# Altium schematic sheet LM-008.SchDoc: Main
size Tabloid; DocumentNumber: LM-008; Revision: B; SheetNumber: 3; SheetTotal: 3; DocumentName: LM-008
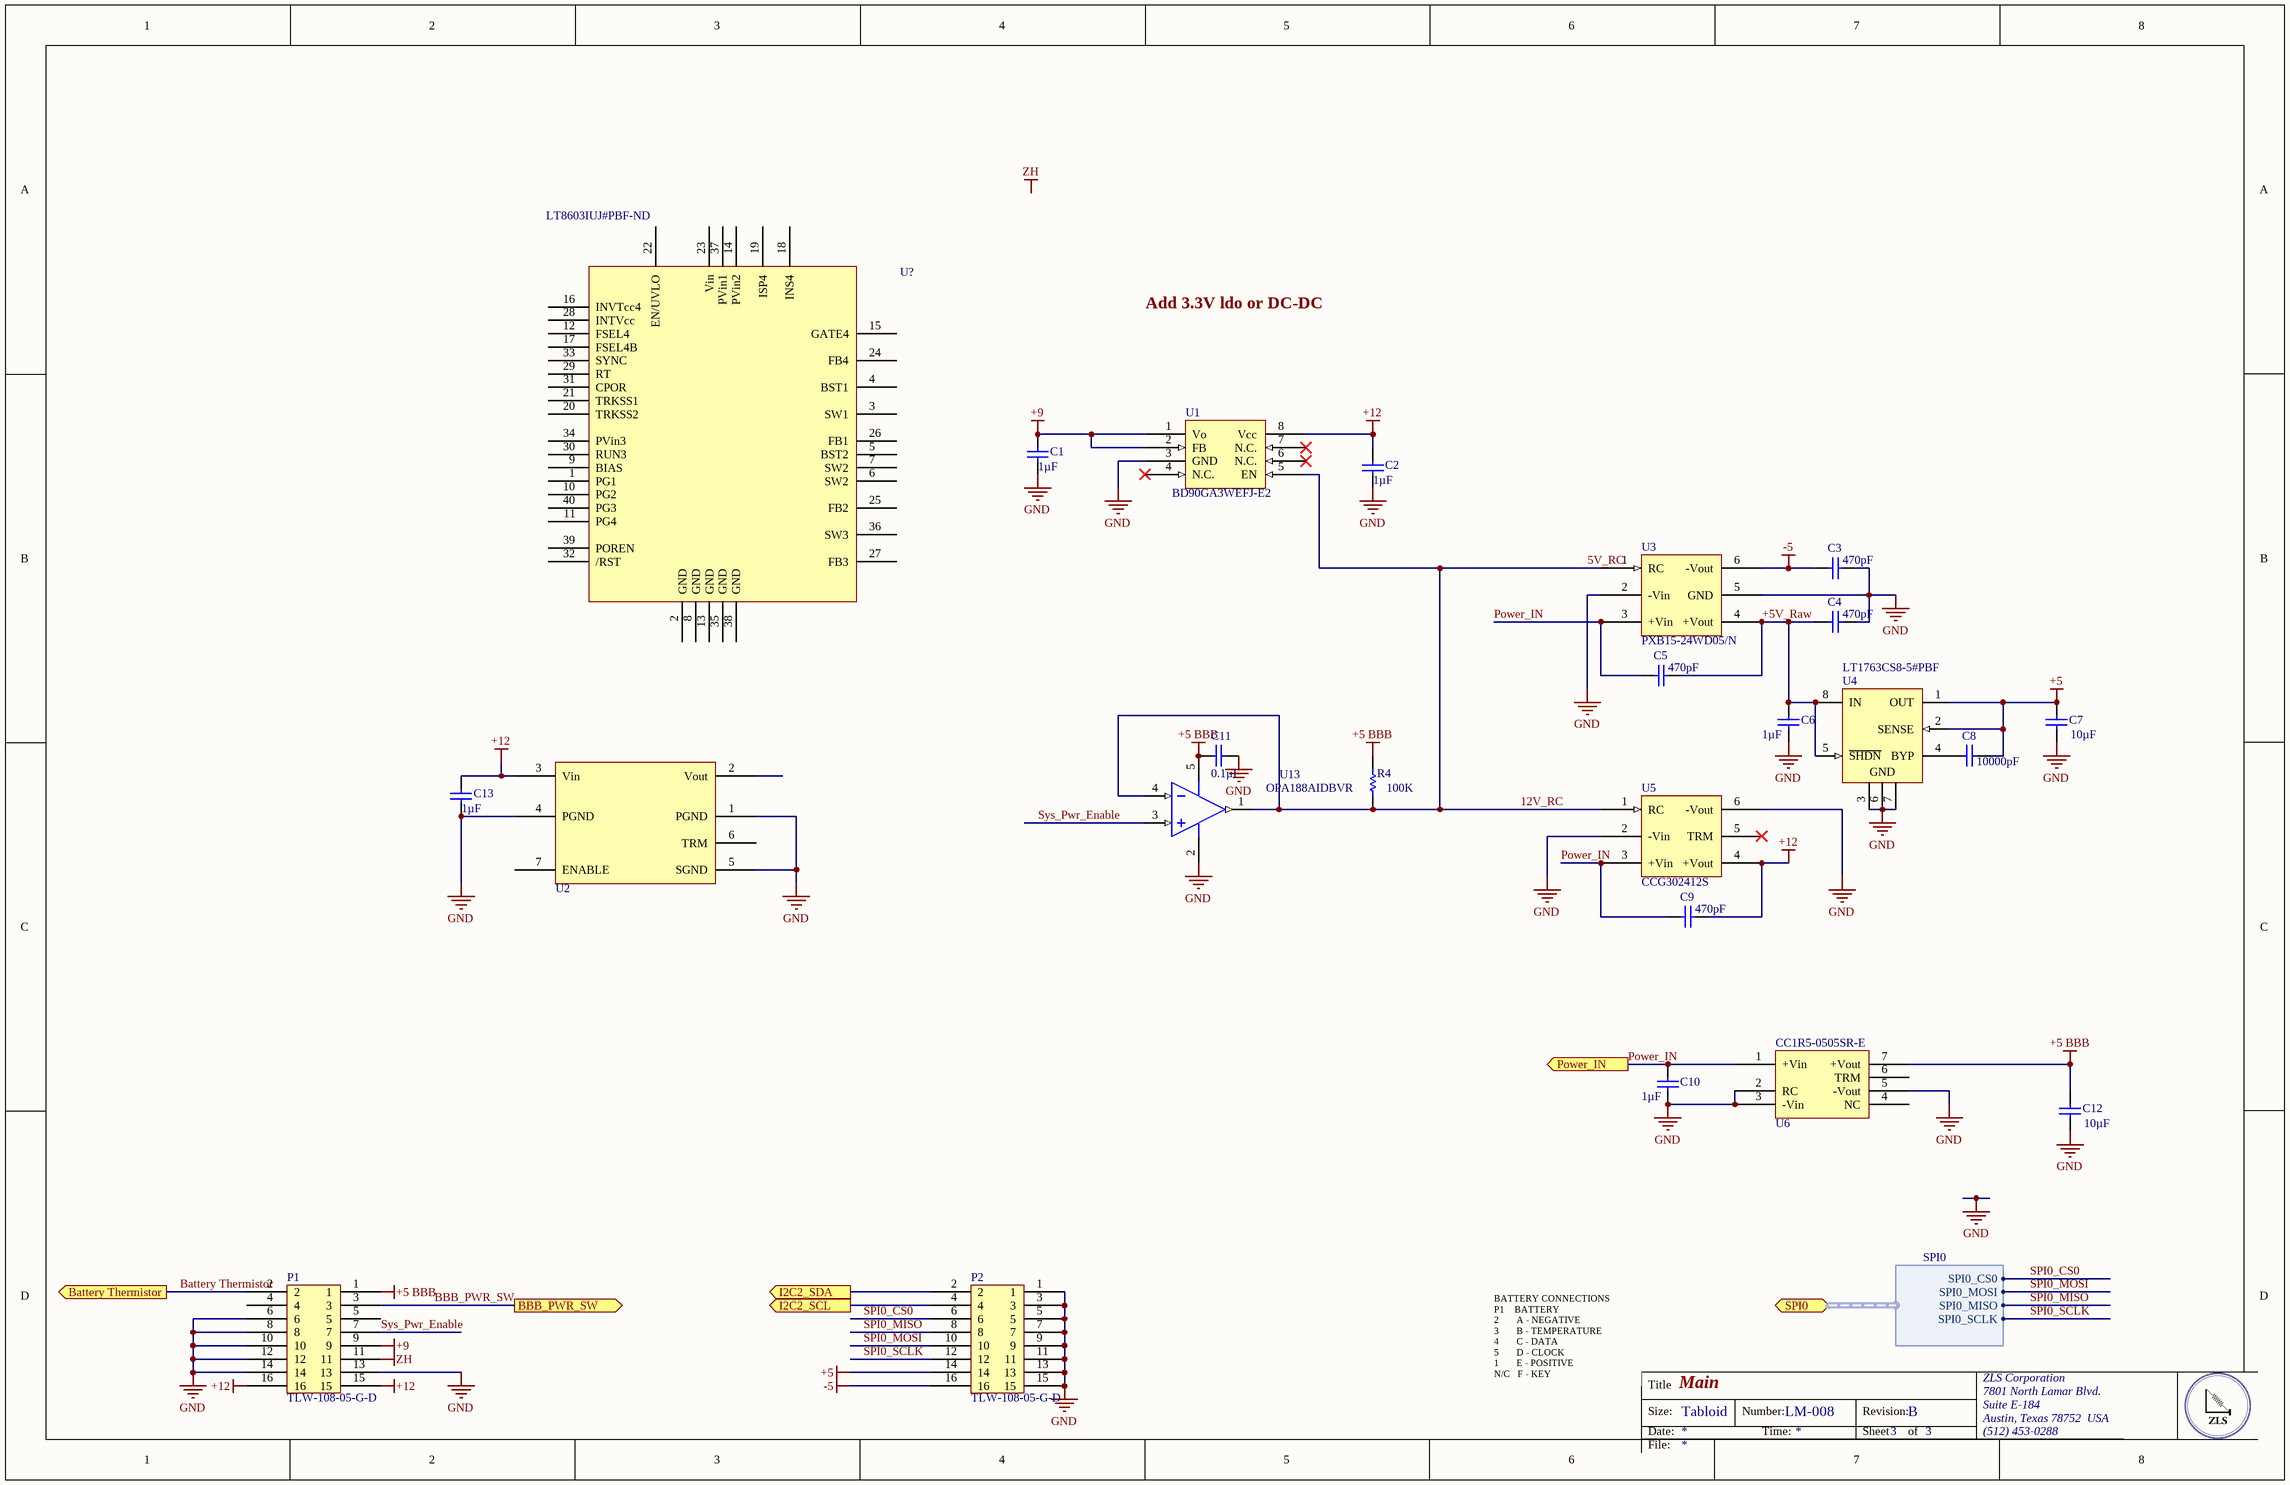
[diagram p0: LM-008.SchDoc]

## Parts
C1  Capacitance: 1µF  [CAPC1206(3216)130_N]  (hidden comment: CAP CER 1UF 50V X7R 1210)
C2  Capacitance: 1µF  [CAPC1206(3216)130_N]  (hidden comment: CAP CER 1UF 50V X7R 1210)
C3  Capacitance: 470pF  [CAPC1812(4532)230_M]  (hidden comment: CAP CER 470PF 3KV X7R 1812)
C4  Capacitance: 470pF  [CAPC1812(4532)230_M]  (hidden comment: CAP CER 470PF 3KV X7R 1812)
C5  Capacitance: 470pF  [CAPC1812(4532)230_M]  (hidden comment: CAP CER 470PF 3KV X7R 1812)
C6  Capacitance: 1µF  [CAPC1210(3225)100_L]  (hidden comment: CAP CER 1UF 50V X7R 1210)
C7  Capacitance: 10µF  [CAPC0805(2012)145_N]  (hidden comment: CAP CER 10UF 10V X7R 0805)
C8  Capacitance: 10000pF  [CAPC0805(2012)145_N]  (hidden comment: CAP CER 10000PF 25V X7R 0805)
C9  Capacitance: 470pF  [CAPC1812(4532)230_M]  (hidden comment: CAP CER 470PF 3KV X7R 1812)
C10  Capacitance: 1µF  [CAPC1210(3225)100_L]  (hidden comment: CAP CER 1UF 50V X7R 1210)
C11  Capacitance: 0.1µF  [CAPC0805(2012)145_N]  (hidden comment: CAP CER 0.1UF 16V X7R 0805)
C12  Capacitance: 10µF  [CAPC0805(2012)145_N]  (hidden comment: CAP CER 10UF 10V X7R 0805)
C13  Capacitance: 1µF  [CAPC0805(2012)145_N]  (hidden comment: CAP CER 1UF 16V X7R 0805)
P1  TLW-108-05-G-D  [TLW-108-05-G-D]
P2  TLW-108-05-G-D  [TLW-108-05-G-D]
R4  100K  [RESC0402(1005)_L]
U1  BD90GA3WEFJ-E2  [TSOP127P600X100-8N]
U2  ABXS002A3X41-SRZ  [ABXS002A3X41-SRZ]  (value not drawn)
U3  PXB15-24WD05/N  [PXB15-24WD05/N]
U4  LT1763CS8-5#PBF  [LT-S8-8_M]
U5  CCG302412S  [CCG30]
U6  CC1R5-0505SR-E  [CC1R5-0505SR-E]
U13  OPA188AIDBVR  [DBV0005A_M]
U?  Supplier Part Number 1: LT8603IUJ#PBF-ND  [LT8603IUJ#PBF]  (hidden comment: LT8603IUJ#PBF)

## Ports
Battery Thermistor (out), BBB_PWR_SW (out), I2C2_SCL (out), I2C2_SDA (out), Power_IN (out), SPI0 (harness SPI0)

## Harnesses
SPI0: SPI0_CS0, SPI0_MOSI, SPI0_MISO, SPI0_SCLK

## Nets
+5: C7.2 C8.1 P2.14 U4.1(OUT) U4.2(SENSE)
+5 BBB: C11.1 C12.2 P1.1 R4.2 U6.7(+Vout) U13.5(V+)
+9: C1.2 P1.9 U1.1(Vo) U1.2(FB)
+12: C2.2 C9.2 C13.2 P1.15 P1.16 U1.8(Vcc) U2.3(Vin) U5.4(+Vout)
-5: C3.1 P2.16 U3.6(-Vout)
GND: C1.1 C2.1 C3.2 C4.2 C6.1 C7.1 C10.1 C11.2 C12.1 C13.1 P1.6 P1.8 P1.10 P1.12 P1.13 P1.14 P2.1 P2.3 P2.5 P2.7 P2.9 P2.11 P2.13 P2.15 U1.3(GND) U2.1(PGND) U2.4(PGND) U2.5(SGND) U3.2(-Vin) U3.5(GND) U4.3(GND) U4.6(GND) U4.7(GND) U5.2(-Vin) U5.6(-Vout) U6.2(RC) U6.3(-Vin) U6.5(-Vout) U13.2(V-)
ZH: P1.11
12V_RC: R4.1 U1.5(EN) U3.1(RC) U5.1(RC) U13.1(OUT) U13.4(IN-)  [also labelled 5V_RC]
+5V_Raw: C4.1 C5.2 C6.2 U3.4(+Vout) U4.5(~{SHDN}) U4.8(IN)
Battery Thermistor: P1.2 ; port Battery Thermistor
BBB_PWR_SW: P1.3 ; port BBB_PWR_SW
I2C2_SCL: P2.4 ; port I2C2_SCL
I2C2_SDA: P2.2 ; port I2C2_SDA
Power_IN: C5.1 C9.1 C10.2 U3.3(+Vin) U5.3(+Vin) U6.1(+Vin) ; port Power_IN
SPI0_CS0: P2.6 ; port SPI0.SPI0_CS0
SPI0_MISO: P2.8 ; port SPI0.SPI0_MISO
SPI0_MOSI: P2.10 ; port SPI0.SPI0_MOSI
SPI0_SCLK: P2.12 ; port SPI0.SPI0_SCLK
Sys_Pwr_Enable: P1.7 U13.3(IN+)
NetC8_2: C8.2 U4.4(BYP)

Not connected (* = marked no-connect by the designer): P1 4 5; U1 4(N.C.)* 6(N.C.)* 7(N.C.)*; U2 2(Vout) 6(TRM) 7(ENABLE); U5 5(TRM)*; U6 4(NC) 6(TRM); U? 1(PG1) 2(GND) 3(SW1) 4(BST1) 5(BST2) 6(SW2) 7(SW2) 8(GND) 9(BIAS) 10(PG2) 11(PG4) 12(FSEL4) 13(GND) 14(PVin2) 15(GATE4) 16(INVTcc4) 17(FSEL4B) 18(INS4) 19(ISP4) 20(TRKSS2) 21(TRKSS1) 22(EN/UVLO) 23(Vin) 24(FB4) 25(FB2) 26(FB1) 27(FB3) 28(INTVcc) 29(RT) 30(RUN3) 31(CPOR) 32(/RST) 33(SYNC) 34(PVin3) 35(GND) 36(SW3) 37(PVin1) 38(GND) 39(POREN) 40(PG3)

## Notes on the sheet
- Add 3.3V ldo or DC-DC
- BATTERY CONNECTIONS
  P1    BATTERY
  2       A - NEGATIVE
  3       B - TEMPERATURE
  4       C - DATA
  5       D - CLOCK
  1       E - POSITIVE
  N/C   F - KEY
- Labels drawn without touching a wire or pin: ZH
- Title
- Size:
- Date:
- Tabloid
- Number:
- Time:
- Revision:
- Sheet
- of
- ZLS Corporation
- 7801 North Lamar Blvd.
- Suite E-184
- Austin, Texas 78752  USA
- (512) 453-0288
- File:

## Library data of the parts
C1 C2 = CMP-1037-04913-1: Manufacturer: Murata Electronics North America; Manufacturer Part Number: GRM32RR71H105KA01L; Tolerance: ±10%; Supplier 1: Digi-Key; Supplier Part Number 1: 490-1863-6-ND; RoHS: RoHS Compliant; Category: Capacitors; Stock 1: 66890; Pricing 1: 1=0.35, 10=0.242, 100=0.1449, 500=0.10868 (USD); Packaging: Digi-Reel®; Part Status: Active; Voltage - Rated: 50V; Temperature Coefficient: X7R; Operating Temperature: -55°C ~ 125°C; Features: -; Ratings: -; Applications: General Purpose; Mounting Type: Surface Mount, MLCC; Package / Case: 1210 (3225 Metric); Size / Dimension: 0.126" L x 0.098" W (3.20mm x 2.50mm); Height - Seated (Max): -; Thickness (Max): 0.079" (2.00mm); Lead Spacing: -; Lead Style: -; ComponentLink1URL: http://search.murata.co.jp/Ceramy/image/img/A01X/G101/ENG/GRM32RR71H105KA01-01.pdf; ComponentLink1Description: http://search.murata.co.jp/Ceramy/image/img/A01X/G101/ENG/GRM32RR71H105KA01-01.pdf
C3-C5 C9 = CMP-1040-00561-1: Manufacturer: Kemet; Manufacturer Part Number: C1812C471KHRACTU; Tolerance: 10%; Supplier 1: Digi-Key; Supplier Part Number 1: 399-7289-6-ND; Stock 1: 2705; Pricing 1: 1=0.88, 10=0.666, 100=0.4761 (USD); Case/Package: 1812; Case Code (Metric): 4532; Case Code (Imperial): 1812; Min Operating Temperature: -55°C; Max Operating Temperature: 125°C; Voltage Rating: 3kV; Packaging: Tape and Reel; Package Quantity: 1; Voltage Rating (DC): 3kV; Length: 0.177inch; Width: 0.126inch; Thickness: 0.071inch; Lead Free: Lead Free; ComponentLink1URL: http://www.kemet.com/docfinder?Partnumber=C1812C471KHRACTU; ComponentLink1Description: http://www.kemet.com/docfinder?Partnumber=C1812C471KHRACTU
C6 C10 = CMP-1038-00632-1: Manufacturer: Murata Electronics North America; Manufacturer Part Number: GRM32RR71H105KA01L; Tolerance: ±10%; Supplier 1: Digi-Key; Supplier Part Number 1: 490-1863-6-ND; RoHS: RoHS Compliant; Category: Capacitors; Stock 1: 66890; Pricing 1: 1=0.35, 10=0.242, 100=0.1449, 500=0.10868 (USD); Packaging: Digi-Reel®; Part Status: Active; Voltage - Rated: 50V; Temperature Coefficient: X7R; Operating Temperature: -55°C ~ 125°C; Features: -; Ratings: -; Applications: General Purpose; Mounting Type: Surface Mount, MLCC; Package / Case: 1210 (3225 Metric); Size / Dimension: 0.126" L x 0.098" W (3.20mm x 2.50mm); Height - Seated (Max): -; Thickness (Max): 0.079" (2.00mm); Lead Spacing: -; Lead Style: -; ComponentLink1URL: http://search.murata.co.jp/Ceramy/image/img/A01X/G101/ENG/GRM32RR71H105KA01-01.pdf; ComponentLink1Description: http://search.murata.co.jp/Ceramy/image/img/A01X/G101/ENG/GRM32RR71H105KA01-01.pdf
C7 C12 = CMP-1036-04795-1: Manufacturer: Murata Electronics North America; Manufacturer Part Number: GCM21BR71A106KE22L; Tolerance: ±10%; Supplier 1: Digi-Key; Supplier Part Number 1: 490-10674-6-ND; RoHS: RoHS Compliant; Category: Capacitors; Stock 1: 136726; Pricing 1: 1=0.49, 10=0.347, 100=0.2282, 500=0.16906, 1000=0.14369 (USD); Packaging: Digi-Reel®; Part Status: Active; Voltage - Rated: 10V; Temperature Coefficient: X7R; Operating Temperature: -55°C ~ 125°C; Features: -; Ratings: AEC-Q200; Applications: Automotive; Mounting Type: Surface Mount, MLCC; Package / Case: 0805 (2012 Metric); Size / Dimension: 0.079" L x 0.049" W (2.00mm x 1.25mm); Height - Seated (Max): -; Thickness (Max): 0.055" (1.40mm); Lead Spacing: -; Lead Style: -; ComponentLink1URL: http://search.murata.co.jp/Ceramy/image/img/A01X/G101/ENG/GCM21BR71A106KE22-01.pdf; ComponentLink1Description: http://search.murata.co.jp/Ceramy/image/img/A01X/G101/ENG/GCM21BR71A106KE22-01.pdf
C8 = CMP-1036-04795-1: Manufacturer: Murata Electronics North America; Manufacturer Part Number: GRM216R71E103KA01D; Tolerance: ±10%; Supplier 1: Digi-Key; Supplier Part Number 1: 490-12748-6-ND; RoHS: RoHS Compliant; Category: Capacitors; Stock 1: 13127; Pricing 1: 1=0.11, 10=0.077, 100=0.0343, 500=0.02452, 1000=0.01926 (USD); Packaging: Digi-Reel®; Part Status: Active; Voltage - Rated: 25V; Temperature Coefficient: X7R; Operating Temperature: -55°C ~ 125°C; Features: -; Ratings: -; Applications: General Purpose; Mounting Type: Surface Mount, MLCC; Package / Case: 0805 (2012 Metric); Size / Dimension: 0.079" L x 0.049" W (2.00mm x 1.25mm); Height - Seated (Max): -; Thickness (Max): 0.028" (0.70mm); Lead Spacing: -; Lead Style: -; ComponentLink1URL: http://www.murata.com/~/media/webrenewal/support/library/catalog/products/capacitor/mlcc/c02e.ashx; ComponentLink1Description: http://www.murata.com/~/media/webrenewal/support/library/catalog/products/capacitor/mlcc/c02e.ashx
C11 = CMP-1036-04795-1: Manufacturer: Murata Electronics North America; Manufacturer Part Number: GRM219R71C104KA01D; Tolerance: ±10%; Voltage - Rated: 25V; Supplier Part Number 1: 490-1673-6-ND; Temperature Coefficient: X7R; Thickness (Max): 0.053" (1.35mm); Supplier 2: Digi-Key; Supplier Part Number 2: 490-1683-6-ND; RoHS: RoHS Compliant; Category: Capacitors; Stock 2: 245331; Pricing 2: 1=0.14, 10=0.098, 100=0.0462, 500=0.0324, 1000=0.02683 (USD); Packaging: Digi-Reel®; Part Status: Active; Operating Temperature: -55°C ~ 125°C; Features: -; Ratings: -; Applications: General Purpose; Mounting Type: Surface Mount, MLCC; Package / Case: 0805 (2012 Metric); Size / Dimension: 0.079" L x 0.049" W (2.00mm x 1.25mm); Height - Seated (Max): -; Lead Spacing: -; Lead Style: -; ComponentLink1URL: http://www.murata.com/~/media/webrenewal/support/library/catalog/products/capacitor/mlcc/c02e.ashx; ComponentLink1Description: http://www.murata.com/~/media/webrenewal/support/library/catalog/products/capacitor/mlcc/c02e.ashx
C13 = CMP-1036-04795-1: Manufacturer: Taiyo Yuden; Manufacturer Part Number: EMK212B7105KG-T; Tolerance: ±10%; Supplier 1: Digi-Key; Supplier Part Number 1: 587-1283-1-ND; RoHS: RoHS Compliant; Category: Capacitors; Stock 1: 41495; Pricing 1: 1=0.13, 10=0.089, 100=0.042, 1000=0.02439 (USD); Packaging: Cut Tape (CT); Part Status: Active; Voltage - Rated: 16V; Temperature Coefficient: X7R; Operating Temperature: -55°C ~ 125°C; Features: -; Ratings: -; Applications: General Purpose; Mounting Type: Surface Mount, MLCC; Package / Case: 0805 (2012 Metric); Size / Dimension: 0.079" L x 0.049" W (2.00mm x 1.25mm); Height - Seated (Max): -; Thickness (Max): 0.053" (1.35mm); Lead Spacing: -; Lead Style: -; ComponentLink1URL: http://ds.yuden.co.jp/TYCOMPAS/ut/detail.do?productNo=EMK212B7105KG-T&fileName=EMK212B7105KG-T_SS&mode=specSheetDownload; ComponentLink1Description: http://ds.yuden.co.jp/TYCOMPAS/ut/detail.do?productNo=EMK212B7105KG-T&fileName=EMK212B7105KG-T_SS&mode=specSheetDownload
P1 P2 = TLW-108-05-G-D: CONN HEADER .100" 16POS DL GOLD; Manufacturer: Samtec Inc.; Pitch - Mating: 0.100" (2.54mm); Number of Positions: 16; Number of Positions Loaded: All; Style: Board to Board or Cable; Shrouding: Unshrouded; Contact Length - Mating: 0.105" (2.67mm); Contact Length - Post: 0.170" (4.32mm); Overall Contact Length: 0.335" (8.51mm); Current Rating: 5.2A per Contact; Supplier 1: Digi-Key; Supplier Part Number 1: SAM1094-08-ND; Manufacturer Part Number: TLW-108-05-G-D; RoHS: RoHS Compliant; Category: Connectors, Interconnects; Stock 1: 0; Pricing 1: 1=4.48, 10=4.006, 100=3.2987, 500=2.60756, 1000=2.23842, 5000=2.04207, 10000=1.96353 (USD); Packaging: Bulk; Part Status: Active; Connector Type: Header; Contact Type: Male Pin; Number of Rows: 2; Row Spacing - Mating: 0.100" (2.54mm); Mounting Type: Through Hole; Termination: Solder; Fastening Type: Push-Pull; Insulation Height: 0.060" (1.52mm); Contact Shape: Square; Contact Finish - Mating: Gold; Contact Finish Thickness - Mating: 10µin (0.25µm); Contact Finish - Post: Gold; Contact Material: Phosphor Bronze; Insulation Material: Liquid Crystal Polymer (LCP); Features: -; Operating Temperature: -55°C ~ 125°C; Ingress Protection: -; Material Flammability Rating: -; Insulation Color: Black; Voltage Rating: -; Mated Stacking Heights: -; Contact Finish Thickness - Post: Flash; Applications: -; ComponentLink1URL: http://suddendocs.samtec.com/prints/tlw-mkt.pdf; ComponentLink1Description: http://suddendocs.samtec.com/prints/tlw-mkt.pdf
R4 = CMP-1011-00927-1: Tolerance: ±1%; Temperature Coefficient: ±100ppm/°C; Supplier Part Number 1: YAG3220CT-ND; Supplier Device Package: 0402
U1 = BD90GA3WEFJ-E2: IC REG LDO 9V 0.3A 8HTSOP-J; Manufacturer: Rohm Semiconductor; Regulator Topology: Positive Fixed; Current - Output: 300mA; Voltage - Dropout (Typical): 0.6V @ 300mA; Voltage - Input: Up to 14V; Supplier 1: Digi-Key; Supplier Part Number 1: BD90GA3WEFJ-E2CT-ND; Manufacturer Part Number: BD90GA3WEFJ-E2; RoHS: RoHS Compliant; Category: Integrated Circuits (ICs); Stock 1: 4781; Pricing 1: 1=0.69, 10=0.606, 25=0.5364, 100=0.4672, 250=0.40664, 500=0.34608, 1000=0.27686 (USD); Packaging: Cut Tape (CT); Part Status: Active; Voltage - Output: 9V; Current - Limit (Min): -; Operating Temperature: -25°C ~ 85°C; Mounting Type: Surface Mount; Package / Case: 8-SOIC (0.154", 3.90mm Width) Exposed Pad; Supplier Device Package: 8-HTSOP-J; ComponentLink1URL: http://rohmfs.rohm.com/en/products/databook/datasheet/ic/power/linear_regulator/bdxxga3wefj-e.pdf; ComponentLink1Description: http://rohmfs.rohm.com/en/products/databook/datasheet/ic/power/linear_regulator/bdxxga3wefj-e.pdf
U3 = CCG302412S: IC CONV DC-DC 15W DUAL 5V PCB; Manufacturer 1: TDK-Lambda Americas Inc.; Category 1: Power Supplies - Board Mount; Number of Outputs: 2; Voltage - Input (Min): 9V; Voltage - Input (Max): 36V; Voltage - Output 2: -5V; Current - Output (Max): 1.5A, 1.5A; Voltage - Isolation: 1.6kV (1600V); Efficiency: 85%; Supplier 1: Digi-Key; Supplier Part Number 1: 285-1902-ND; Manufacturer Part Number 1: PXB15-24WD05/N; RoHS 1: RoHS Compliant; Description 1: IC CONV DC-DC 15W DUAL 5V PCB; Stock 1: 28; Pricing 1: 1=61.61, 10=59.59 (USD); Packaging: Tube; Part Status: Active; Type: Isolated Module; Voltage - Output 1: 5V; Voltage - Output 3: -; Power (Watts): 15W; Applications: ITE (Commercial); Features: Remote On/Off, OCP, OVP, SCP; Operating Temperature: -40°C ~ 85°C; Mounting Type: Through Hole; Package / Case: 6-DIP Module; Size / Dimension: 1.00" L x 1.00" W x 0.39" H (25.4mm x 25.4mm x 9.9mm); ComponentLink1URL: http://us.tdk-lambda.com/ftp/AppNotes/pxb15w-d_appnote.pdf; ComponentLink1Description: http://us.tdk-lambda.com/ftp/AppNotes/pxb15w-d_appnote.pdf
U4 = CMP-0476-01685-1: 500 mA, Low Noise, LDO Micropower Regulator, 1.8 to 20 V Vin, 5 V Vout, 8-pin SOIC (S8-8), -40 to 125 degC, Pb-Free; Manufacturer: Linear Technology; Output Voltage: 5 V; Vin Min(V): 1.8; Discrete Pass Element: no; Number of Outputs: 1; Dropout Voltage(V): 0.3; Vin Max(V): 20; PSRR(dB): 65; Iout(mA): 500; Isupply(mA): 0.03; Mounting Technology: Surface Mount; ComponentLink3Description: Package Specification; PartNumber: LT1763CS8-5#PBF; PackageDescription: 8-Pin Plastic Small Outline (Narrow .150 Inch), Body 4.9 x 3.9 mm, Pitch 1.27 mm; DatasheetVersion: Rev. G; ComponentLink2URL: http://cds.linear.com/docs/en/datasheet/1763fg.pdf; PackageReference: S8-8; ComponentLink1URL: http://www.linear.com/; ComponentLink2Description: Datasheet; ComponentLink1Description: Manufacturer URL; PackageVersion: Rev. G, 03/2012; Shutdown Current(uA): 1; ComponentLink3URL: http://cds.linear.com/docs/en/packaging/05081610_G_SO8.pdf; RoHS: TRUE; Noise(uV): 20
U5 = CCG302412S: DC/DC CONVERTER 12V 2.5A PCB; Power (Watts) - Manufacture Series: 30W; Manufacturer 1: TDK-Lambda Americas Inc; Number of Outputs: 1; Voltage - Input (Min): 9V; Voltage - Input (Max): 36V; Voltage - Isolation: 1.5kV (1500V); Efficiency: 89%; Category 1: Power Supplies - Board Mount; Packaging: Tube; Type: Isolated Module; Voltage - Output 1: 12V; Voltage - Output 2: -; Voltage - Output 3: -; Current - Output (Max): 2.5A; Features: Remote On/Off, OCP; Mounting Type: Through Hole; Package / Case: 6-DIP Module (6 Leads); Size / Dimension: 1.00" L x 1.00" W x 0.39" H (25.4mm x 25.4mm x 9.9mm); Operating Temperature: -40°C ~ 85°C; Power (Watts) - Max: 30W; ComponentLink1URL: http://www.us.tdk-lambda.com/ftp/specs/ccg30.pdf; ComponentLink1Description: http://www.us.tdk-lambda.com/ftp/specs/ccg30.pdf; Supplier 1: Digi-Key; Supplier Part Number 1: 285-2419-ND; Manufacturer Part Number 1: CCG302412S; RoHS 1: RoHS Compliant; Description 1: DC/DC CONVERTER 12V 2.5A PCB; Stock 1: 30; Pricing 1: 1=43.63, 10=42.95 (USD)
U6 = CC1R5-0505SR-E: CONV DC/DC 1.5W SNGL 5V 5V SMD; Manufacturer: TDK-Lambda Americas Inc.; Number of Outputs: 1; Voltage - Input (Min): 4.5V; Voltage - Input (Max): 9V; Current - Output (Max): 300mA; Power (Watts): 1W; Voltage - Isolation: 500V; Supplier 1: Digi-Key; Supplier Part Number 1: 445-3267-ND; Manufacturer Part Number: CC1R5-0505SR-E; RoHS: RoHS Compliant; Category: Power Supplies - Board Mount; Stock 1: 174; Pricing 1: 1=9.7, 10=9.24 (USD); Packaging: Tray; Part Status: Active; Type: Isolated Module; Voltage - Output 1: 5V; Voltage - Output 2: -; Voltage - Output 3: -; Applications: ITE (Commercial); Features: -; Operating Temperature: -40°C ~ 85°C; Efficiency: -; Mounting Type: Surface Mount; Package / Case: 7-SMD Module; Size / Dimension: 0.65" L x 0.65" W x 0.35" H (16.5mm x 16.6mm x 8.8mm); ComponentLink1URL: http://www.us.tdk-lambda.com/ftp/specs/CC1R5-xR-E_spc_en.pdf; ComponentLink1Description: http://www.us.tdk-lambda.com/ftp/specs/CC1R5-xR-E_spc_en.pdf
U13 = CMP-0809-00005-2: Precision, Low Noise, Rail-to-Rail Output, Zero-Drift Operational Amplifier, 4 to 36 V, -40 to 125 degC, 5-pin SOT23 (DBV5), Green (RoHS & no Sb/Br); Manufacturer: Texas Instruments; Total Supply Voltage(Min)(+5V is 5, +/-5V is 10): 4; Offset Drift(Typ)(uV/C): 0.03; Rating: Catalog; SubFamily: Zero Drift Precision Amplifier; GBW(Typ)(MHz): 2; Slew Rate(Typ)(V/us): 0.8; Number of Channels: 1; CMRR(Min)(dB): 120; Iq per channel(Max)(mA): 0.51; Total Supply Voltage(Max)(+5V is 5, +/-5V is 10): 36; PartNumber: OPA188AIDBVR; ComponentLink2Description: Datasheet; ComponentLink2URL: http://www.ti.com/lit/ds/symlink/opa188.pdf; ComponentLink1Description: Manufacturer URL; Mounting Technology: Surface Mount; Eco-Plan: Green (RoHS & no Sb/Br); ComponentLink1URL: http://www.ti.com/; PackageVersion: 4073253-4/K, 03/2006; DatasheetVersion: SBOS642A; ComponentLink3Description: Package Specification; PackageReference: DBV0005A; ComponentLink3URL: http://www.ti.com/litv/pdf/mpds018i; PackageDescription: 5-Pin Plastic Small Outline, Body 1.6 x 2.9 mm, Pitch 0.95 mm; Code_JEDEC: MO-178
U? = LT8603IUJ#PBF: Manufacturer: Linear Technology/Analog Devices; Description: IC REG BUCK ADJ QUAD 40QFN; Output Type: Transistor Driver; Function: Step-Up/Step-Down; Output Configuration: Positive; Topology: Buck-Boost; Output Phases: 2; Voltage - Supply (Vcc/Vdd): 3 V ~ 42 V; Frequency - Switching: 250kHz ~ 2.2MHz; Synchronous Rectifier: Yes; Control Features: Current Limit, Power Good, Soft Start; Supplier 1: Digi-Key; Manufacturer Part Number: LT8603IUJ#PBF; RoHS: RoHS Compliant; Category: Integrated Circuits (ICs); Stock 1: 11; Pricing 1: 1=12.81, 25=8.5884, 100=7.293 (USD); Packaging: Tube; Part Status: Active; Duty Cycle (Max): -; Clock Sync: Yes; Serial Interfaces: -; Operating Temperature: -40°C ~ 125°C (TJ); Package / Case: 40-WFQFN Exposed Pad; Supplier Device Package: 40-QFN (6x6); Base Part Number: LT8603; ComponentLink1URL: http://www.linear.com/docs/59072; ComponentLink1Description: http://www.linear.com/docs/59072
U2 = ABXS002A3X41-SRZ: Supplier 1: Digi-Key; Supplier Part Number 1: 555-1388-1-ND